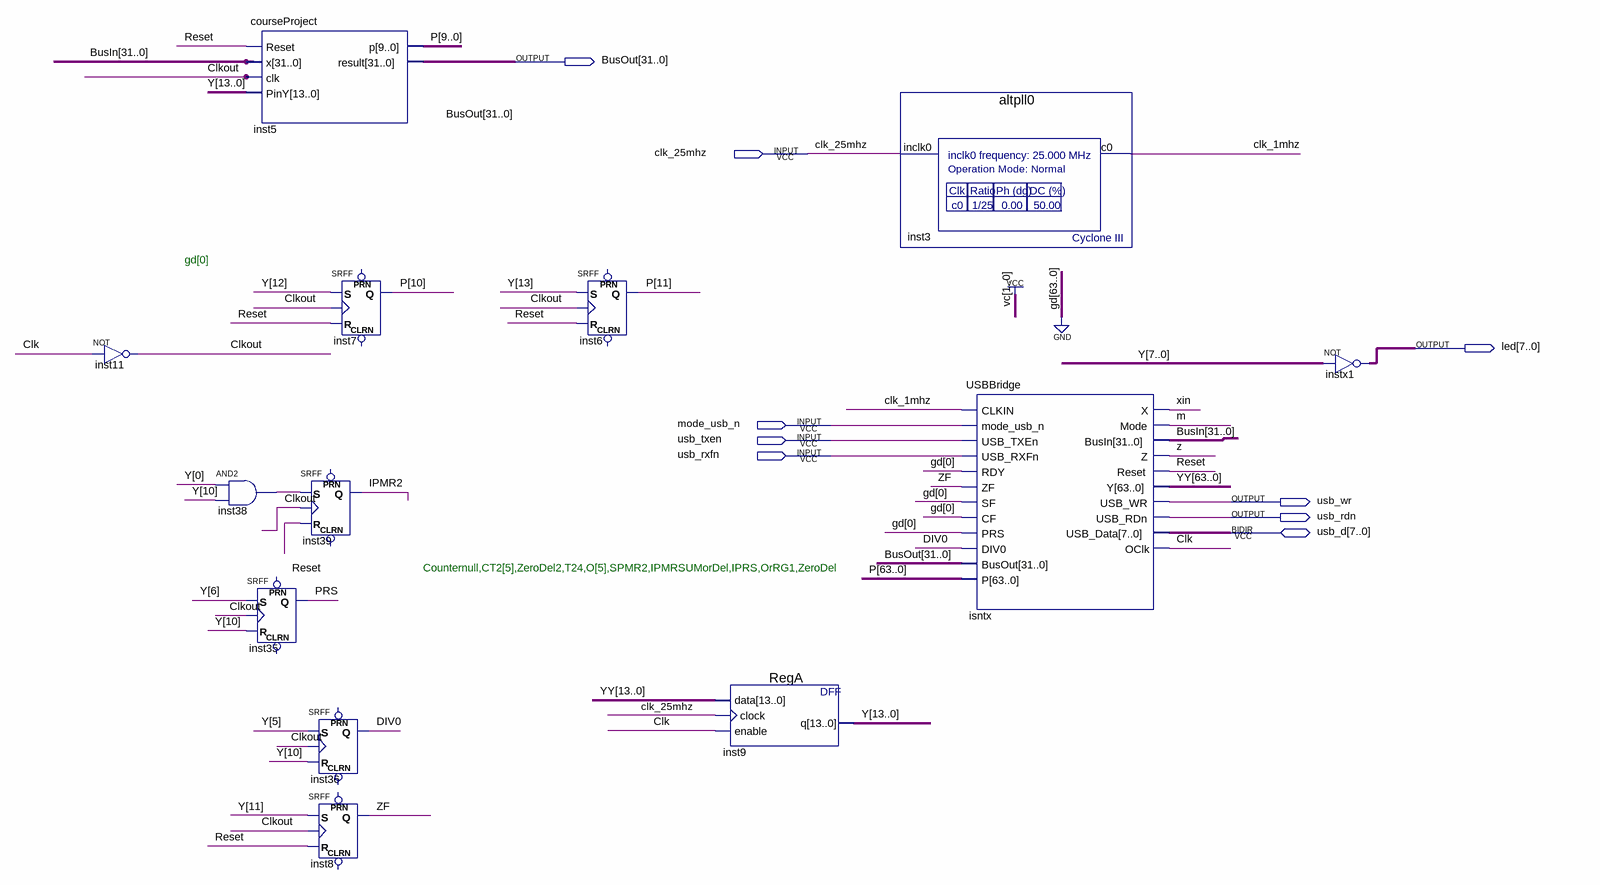
[diagram p0: schematic sheet]
// Quartus schematic Laba3_3oper.bdf as structural Verilog: 13 symbols, 9 pins
module Laba3_3oper (
  input  clk_25mhz,
  input  mode_usb_n,
  input  usb_txen,
  input  usb_rxfn,
  inout  [7:0] usb_d,
  output [31:0] BusOut,
  output [7:0] led,
  output usb_wr,
  output usb_rdn
);

  wire Clk, clk_1mhz, Clkout, DIV0, inst38_out, IPMR2, m, PRS, Reset, xin, z, ZF;
  wire [13:0] Y;
  wire [31:0] BusIn;
  wire [63:0] P, YY;

  not inst11 (Clkout, Clk);
  courseProject inst5 (.Reset(Reset), .x(BusIn), .clk(Clkout), .PinY(Y), .p(P[9:0]), .result(BusOut));
  and inst38 (inst38_out, Y[0], Y[10]);
  SRFF inst35 (.S(Y[6]), .R(Y[10]), .CLK(Clkout), .Q(PRS));  // open: PRN, CLRN
  SRFF inst39 (.S(inst38_out), .R(Reset), .CLK(Clkout), .Q(IPMR2));  // open: PRN, CLRN
  SRFF inst36 (.S(Y[5]), .R(Y[10]), .CLK(Clkout), .Q(DIV0));  // open: PRN, CLRN
  SRFF inst8 (.S(Y[11]), .R(Reset), .CLK(Clkout), .Q(ZF));  // open: PRN, CLRN
  SRFF inst7 (.S(Y[12]), .R(Reset), .CLK(Clkout), .Q(P[10]));  // open: PRN, CLRN
  SRFF inst6 (.S(Y[13]), .R(Reset), .CLK(Clkout), .Q(P[11]));  // open: PRN, CLRN
  RegA inst9 (.data(YY[13:0]), .clock(clk_25mhz), .enable(Clk), .q(Y));
  altpll0 inst3 (.inclk0(clk_25mhz), .c0(clk_1mhz));
  USBBridge isntx (
    .CLKIN(clk_1mhz), .mode_usb_n(mode_usb_n), .USB_TXEn(usb_txen), .USB_RXFn(usb_rxfn), .RDY(1'b0), .ZF(ZF),
    .SF(1'b0), .CF(1'b0), .PRS(1'b0), .DIV0(DIV0), .BusOut(BusOut), .P(P), .X(xin), .Mode(m), .BusIn(BusIn),
    .Z(z), .Reset(Reset), .Y(YY), .USB_WR(usb_wr), .USB_RDn(usb_rdn), .OClk(Clk), .USB_Data(usb_d));
  assign led = ~Y[7:0];  // NOT instx1, 8 bits wide

  // Notes on the sheet:
  //   gd[0]
  //   Counternull,CT2[5],ZeroDel2,T24,O[5],SPMR2,IPMRSUMorDel,IPRS,OrRG1,ZeroDel
endmodule
